# Altium schematic sheet EIS_Main.SchDoc: EIS: Main
size A4; Organization: Hahn-Schickard; Address1: Wilhelm-Schickard-Str. 10; Address2: 78052 Villingen-Schwenningen; Address3: Bernd.Ehrbrecht@Hahn-Schickard.de; DocumentNumber: 1; Revision: 1.0; SheetNumber: 1; SheetTotal: 7; PhoneNumber: 0 7721 943 137; E-Mail: Xxxx.Xxxx@Hahn-Schickard.de; ProjectName: Project File Name
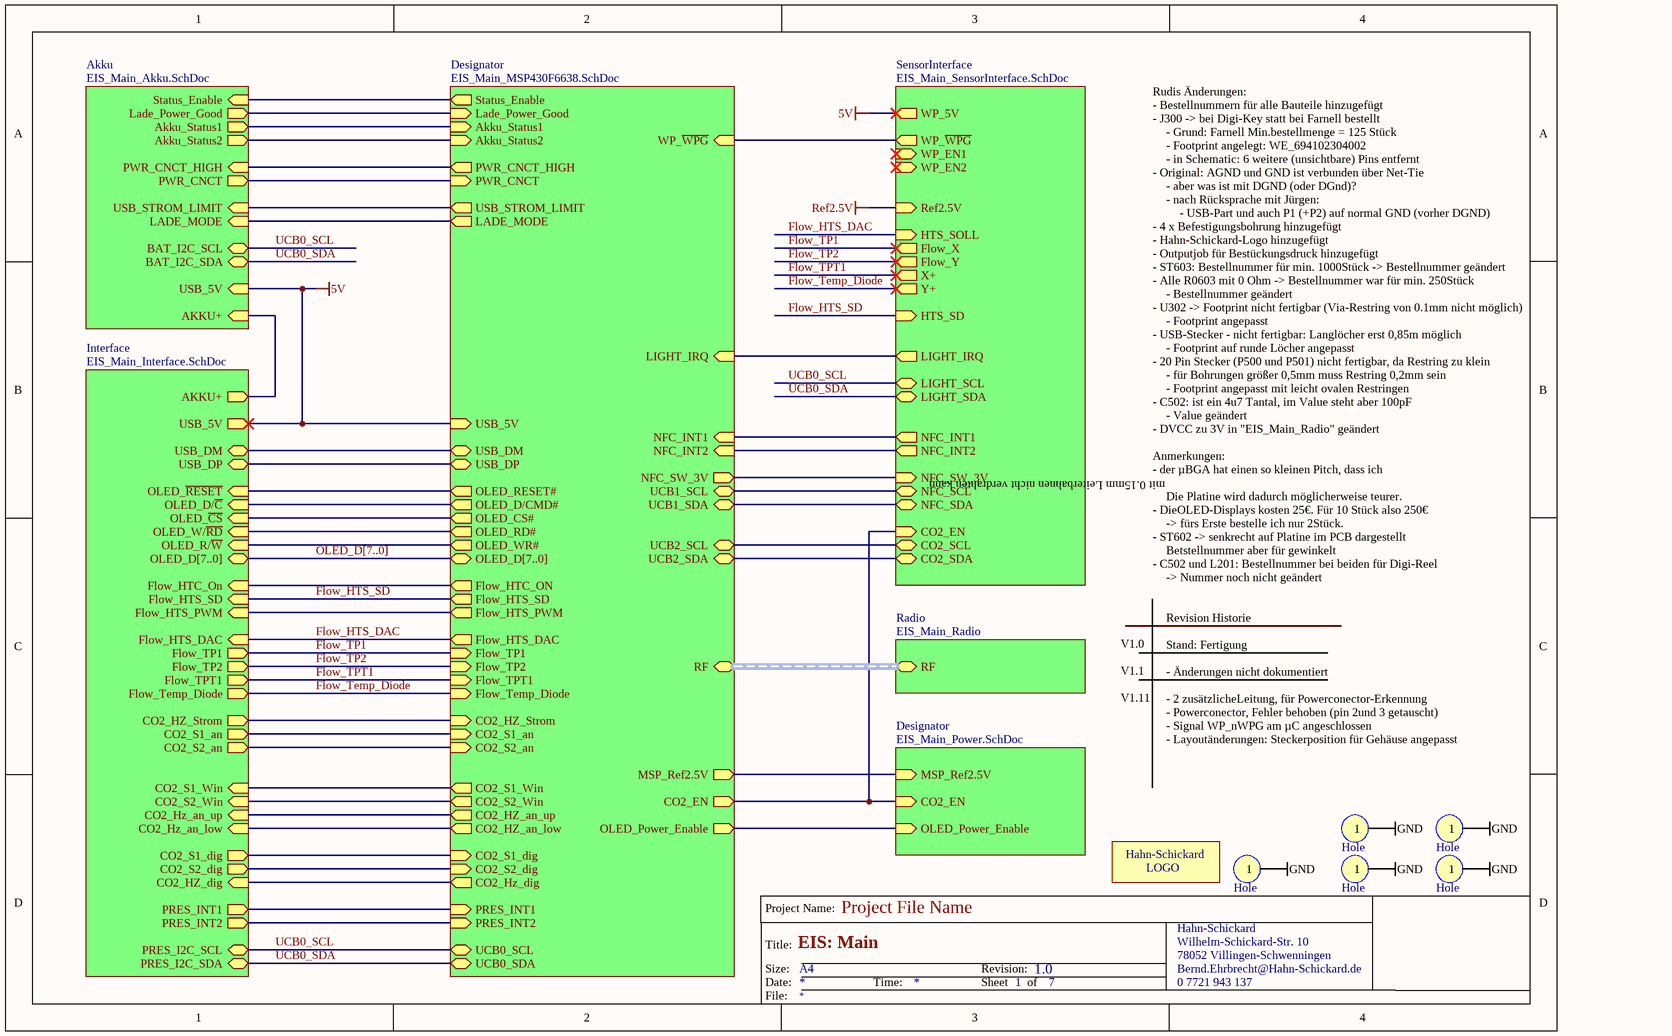
[diagram p0: EIS_Main.SchDoc]

## Parts
LOGO1  Hahn-Schickard-Logo  [Hahn-Schickard-LOGO_klein]  (value not drawn)
X1  Hole  [Hole_2mm]
X2  Hole  [Hole_2mm]
X3  Hole  [Hole_2mm]
X4  Hole  [Hole_2mm]
X5  Hole  [Hole_2mm]

## Sub-sheets
Akku = EIS_Main_Akku.SchDoc: LADE_MODE (in), USB_STROM_LIMIT (in), Akku_Status1 (out), Akku_Status2 (out), BAT_I2C_SDA (bidir), BAT_I2C_SCL (bidir), USB_5V (in), Lade_Power_Good (out), Status_Enable (in), AKKU+ (in), PWR_CNCT (out), PWR_CNCT_HIGH (in)
Designator = EIS_Main_MSP430F6638.SchDoc: Flow_HTC_ON (out), OLED_D/CMD# (out), Flow_HTS_DAC (out), PRES_INT1 (in), LADE_MODE (out), USB_STROM_LIMIT (out), Akku_Status1 (in), Akku_Status2 (in), OLED_Power_Enable (out), Flow_TPT1 (in), Flow_TP1 (in), Flow_TP2 (in), Flow_Temp_Diode (in), UCB0_SCL (bidir), UCB0_SDA (bidir), CO2_S2_dig (in), CO2_S1_dig (in), CO2_HZ_Strom (in), CO2_Hz_dig (out), CO2_S1_an (in), CO2_S2_an (in), MSP_Ref2.5V (out), OLED_RESET# (out), OLED_CS# (out), USB_5V (in), CO2_HZ_an_low (out), CO2_S2_Win (out), CO2_S1_Win (out), CO2_HZ_an_up (out), PRES_INT2 (in), OLED_WR# (out), OLED_RD# (out), USB_DM (bidir), USB_DP (bidir), OLED_D[7..0] (bidir), RF (harness RF), Flow_HTS_SD (out), Flow_HTS_PWM (out), UCB1_SCL (bidir), UCB1_SDA (bidir), UCB2_SDA (bidir), UCB2_SCL (bidir), Lade_Power_Good (in), Status_Enable (out), CO2_EN (out), NFC_SW_3V (out), NFC_INT1 (in), NFC_INT2 (in), LIGHT_IRQ (in), WP_~{WPG} (in), PWR_CNCT (in), PWR_CNCT_HIGH (out)
Designator = EIS_Main_Power.SchDoc: CO2_EN (in), OLED_Power_Enable (in), MSP_Ref2.5V (in)
Interface = EIS_Main_Interface.SchDoc: USB_5V (out), USB_DM (bidir), USB_DP (bidir), OLED_D[7..0] (bidir), OLED_~{CS} (in), OLED_~{RESET} (in), OLED_D/~{C} (in), OLED_R/~{W} (in), OLED_W/~{RD} (in), Flow_TP2 (out), Flow_Temp_Diode (out), CO2_S2_an (out), CO2_S2_Win (in), CO2_Hz_an_low (in), Flow_HTS_SD (in), CO2_HZ_dig (in), CO2_S2_dig (out), PRES_INT2 (out), PRES_I2C_SDA (bidir), AKKU+ (out), Flow_TP1 (out), Flow_TPT1 (out), CO2_S1_an (out), CO2_HZ_Strom (out), Flow_HTS_DAC (in), CO2_S1_Win (in), CO2_Hz_an_up (in), Flow_HTC_On (in), Flow_HTS_PWM (in), CO2_S1_dig (out), PRES_INT1 (out), PRES_I2C_SCL (bidir)
Radio = EIS_Main_Radio: RF (harness RF)
SensorInterface = EIS_Main_SensorInterface.SchDoc: WP_5V (out), WP_~{WPG} (out), WP_EN1 (in), WP_EN2 (in), NFC_SW_3V (in), NFC_SDA (bidir), NFC_SCL (bidir), NFC_INT1 (out), NFC_INT2 (out), HTS_SD (in), HTS_SOLL (in), Flow_X (out), Flow_Y (out), X+ (out), Y+ (out), Ref2.5V (in), LIGHT_IRQ (out), LIGHT_SDA (bidir), LIGHT_SCL (bidir), CO2_SCL (bidir), CO2_SDA (bidir), CO2_EN (in)

## Nets
5V: sheet Akku/USB_5V, sheet Interface/USB_5V, sheet Designator/USB_5V, sheet SensorInterface/WP_5V
GND: X1.1 X2.1 X3.1 X4.1 X5.1
Ref2.5V: sheet SensorInterface/Ref2.5V
Flow_HTS_DAC: sheet Interface/Flow_HTS_DAC, sheet Designator/Flow_HTS_DAC, sheet SensorInterface/HTS_SOLL
Flow_HTS_SD: sheet Interface/Flow_HTS_SD, sheet Designator/Flow_HTS_SD, sheet SensorInterface/HTS_SD
Flow_Temp_Diode: sheet Interface/Flow_Temp_Diode, sheet Designator/Flow_Temp_Diode, sheet SensorInterface/Y+
Flow_TP1: sheet Interface/Flow_TP1, sheet Designator/Flow_TP1, sheet SensorInterface/Flow_X
Flow_TP2: sheet Interface/Flow_TP2, sheet Designator/Flow_TP2, sheet SensorInterface/Flow_Y
Flow_TPT1: sheet Interface/Flow_TPT1, sheet Designator/Flow_TPT1, sheet SensorInterface/X+
UCB0_SCL: sheet Akku/BAT_I2C_SCL, sheet Interface/PRES_I2C_SCL, sheet Designator/UCB0_SCL, sheet SensorInterface/LIGHT_SCL
UCB0_SDA: sheet Akku/BAT_I2C_SDA, sheet Interface/PRES_I2C_SDA, sheet Designator/UCB0_SDA, sheet SensorInterface/LIGHT_SDA
(unnamed): sheet Akku/LADE_MODE, sheet Designator/LADE_MODE
(unnamed): sheet Akku/USB_STROM_LIMIT, sheet Designator/USB_STROM_LIMIT
(unnamed): sheet Akku/Akku_Status1, sheet Designator/Akku_Status1
(unnamed): sheet Akku/Akku_Status2, sheet Designator/Akku_Status2
(unnamed): sheet Akku/Lade_Power_Good, sheet Designator/Lade_Power_Good
(unnamed): sheet Akku/Status_Enable, sheet Designator/Status_Enable
(unnamed): sheet Akku/AKKU+, sheet Interface/AKKU+
(unnamed): sheet Akku/PWR_CNCT, sheet Designator/PWR_CNCT
(unnamed): sheet Akku/PWR_CNCT_HIGH, sheet Designator/PWR_CNCT_HIGH
(unnamed): sheet Interface/USB_DM, sheet Designator/USB_DM
(unnamed): sheet Interface/USB_DP, sheet Designator/USB_DP
(unnamed): sheet Interface/OLED_~{CS}, sheet Designator/OLED_CS#
(unnamed): sheet Interface/OLED_~{RESET}, sheet Designator/OLED_RESET#
(unnamed): sheet Interface/OLED_D/~{C}, sheet Designator/OLED_D/CMD#
(unnamed): sheet Interface/OLED_R/~{W}, sheet Designator/OLED_WR#
(unnamed): sheet Interface/OLED_W/~{RD}, sheet Designator/OLED_RD#
(unnamed): sheet Interface/CO2_S2_an, sheet Designator/CO2_S2_an
(unnamed): sheet Interface/CO2_S2_Win, sheet Designator/CO2_S2_Win
(unnamed): sheet Interface/CO2_Hz_an_low, sheet Designator/CO2_HZ_an_low
(unnamed): sheet Interface/CO2_HZ_dig, sheet Designator/CO2_Hz_dig
(unnamed): sheet Interface/CO2_S2_dig, sheet Designator/CO2_S2_dig
(unnamed): sheet Interface/PRES_INT2, sheet Designator/PRES_INT2
(unnamed): sheet Interface/CO2_S1_an, sheet Designator/CO2_S1_an
(unnamed): sheet Interface/CO2_HZ_Strom, sheet Designator/CO2_HZ_Strom
(unnamed): sheet Interface/CO2_S1_Win, sheet Designator/CO2_S1_Win
(unnamed): sheet Interface/CO2_Hz_an_up, sheet Designator/CO2_HZ_an_up
(unnamed): sheet Interface/Flow_HTC_On, sheet Designator/Flow_HTC_ON
(unnamed): sheet Interface/Flow_HTS_PWM, sheet Designator/Flow_HTS_PWM
(unnamed): sheet Interface/CO2_S1_dig, sheet Designator/CO2_S1_dig
(unnamed): sheet Interface/PRES_INT1, sheet Designator/PRES_INT1
(unnamed): sheet Designator/OLED_Power_Enable, sheet Designator/OLED_Power_Enable
(unnamed): sheet Designator/MSP_Ref2.5V, sheet Designator/MSP_Ref2.5V
(unnamed): sheet Designator/UCB1_SCL, sheet SensorInterface/NFC_SCL
(unnamed): sheet Designator/UCB1_SDA, sheet SensorInterface/NFC_SDA
(unnamed): sheet Designator/UCB2_SDA, sheet SensorInterface/CO2_SDA
(unnamed): sheet Designator/UCB2_SCL, sheet SensorInterface/CO2_SCL
(unnamed): sheet Designator/CO2_EN, sheet SensorInterface/CO2_EN, sheet Designator/CO2_EN
(unnamed): sheet Designator/NFC_SW_3V, sheet SensorInterface/NFC_SW_3V
(unnamed): sheet Designator/NFC_INT1, sheet SensorInterface/NFC_INT1
(unnamed): sheet Designator/NFC_INT2, sheet SensorInterface/NFC_INT2
(unnamed): sheet Designator/LIGHT_IRQ, sheet SensorInterface/LIGHT_IRQ
(unnamed): sheet Designator/WP_~{WPG}, sheet SensorInterface/WP_~{WPG}

## Buses and harness runs
bus OLED_D[7..0] = sheet Designator/OLED_D[7..0] = sheet Interface/OLED_D[7..0]
harness sheet Designator/RF = sheet Radio/RF

## Notes on the sheet
- Rudis Änderungen:
- - Bestellnummern für alle Bauteile hinzugefügt
- - J300 -> bei Digi-Key statt bei Farnell bestellt
- - Original: AGND und GND ist verbunden über Net-Tie
- - Grund: Farnell Min.bestellmenge = 125 Stück
- - Footprint angelegt: WE_694102304002
- - in Schematic: 6 weitere (unsichtbare) Pins entfernt
- - 4 x Befestigungsbohrung hinzugefügt
- - Hahn-Schickard-Logo hinzugefügt
- - aber was ist mit DGND (oder DGnd)?
- - nach Rücksprache mit Jürgen:
- - USB-Part und auch P1 (+P2) auf normal GND (vorher DGND)
- - Outputjob für Bestückungsdruck hinzugefügt
- - ST603: Bestellnummer für min. 1000Stück -> Bestellnummer geändert
- - Alle R0603 mit 0 Ohm -> Bestellnummer war für min. 250Stück
- - U302 -> Footprint nicht fertigbar (Via-Restring von 0.1mm nicht möglich)
- - Bestellnummer geändert
- - USB-Stecker - nicht fertigbar: Langlöcher erst 0,85m möglich
- - 20 Pin Stecker (P500 und P501) nicht fertigbar, da Restring zu klein
- - Footprint angepasst
- - Footprint auf runde Löcher angepasst
- - für Bohrungen größer 0,5mm muss Restring 0,2mm sein
- - C502: ist ein 4u7 Tantal, im Value steht aber 100pF
- - DVCC zu 3V in "EIS_Main_Radio" geändert
- - Footprint angepasst mit leicht ovalen Restringen
- - Value geändert
- - der µBGA hat einen so kleinen Pitch, dass ich
- Anmerkungen:
- - DieOLED-Displays kosten 25€. Für 10 Stück also 250€
- mit 0.15mm Leiterbahnen nicht verdrahten kann
- Die Platine wird dadurch möglicherweise teurer.
- - ST602 -> senkrecht auf Platine im PCB dargestellt
- - C502 und L201: Bestellnummer bei beiden für Digi-Reel
- -> fürs Erste bestelle ich nur 2Stück.
- Betstellnummer aber für gewinkelt
- -> Nummer noch nicht geändert
- V1.0
- Revision Historie
- Stand: Fertigung
- V1.1
- V1.11
- - Änderungen nicht dokumentiert
- - 2 zusätzlicheLeitung, für Powerconector-Erkennung
- - Powerconector, Fehler behoben (pin 2und 3 getauscht)
- - Signal WP_nWPG am µC angeschlossen
- - Layoutänderungen: Steckerposition für Gehäuse angepasst
- Project Name:
- Size:
- Date:
- Title:
- A4
- Time:
- Revision:
- Sheet
- of
- File:
- (in symbol Hahn-Schickard-Logo) Hahn-Schickard; LOGO

## Library data of the parts
LOGO1 = Hahn-Schickard-Logo: Hahn-Schickard Logo als Footprint
X1-X5 = Hole: Durchkontaktierung d=4mm